# EAGLE design sqw_11p (EAGLE 5.11)
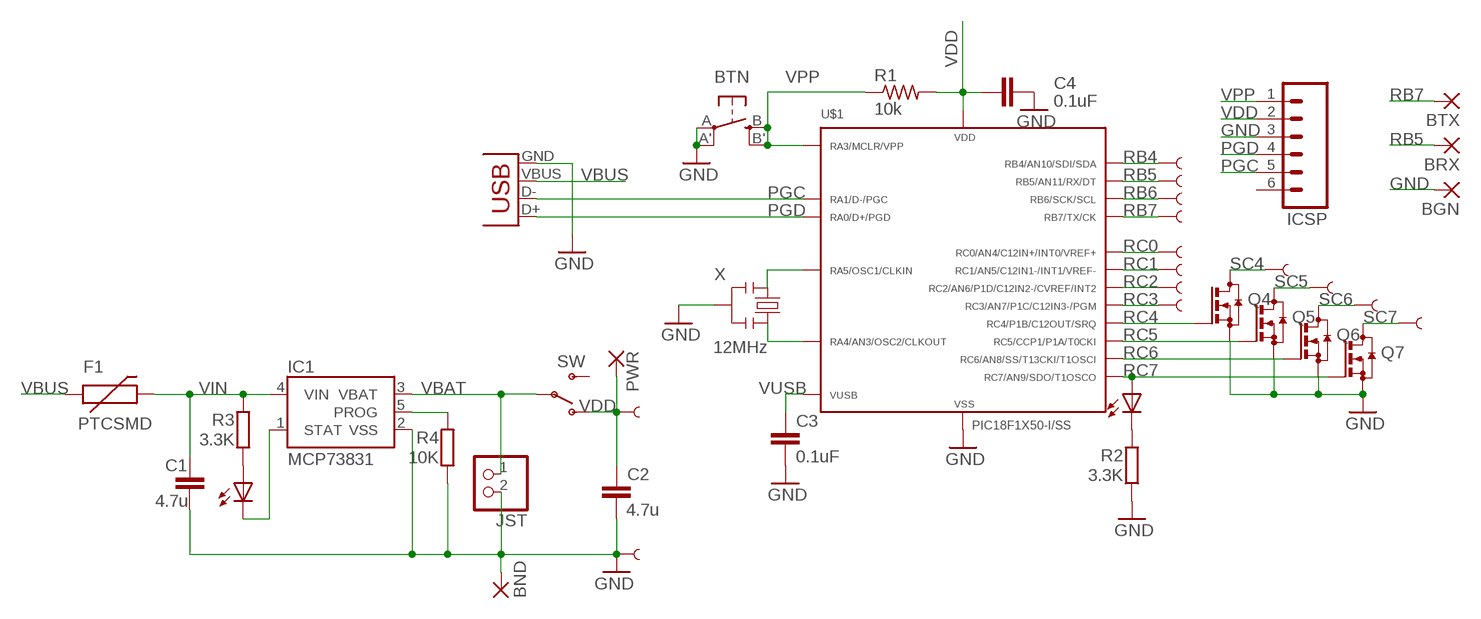
[diagram p0: schematic, sheet 1]

## Parts
BGN  SMD2  [SMD1,27-2,54]
BND  SMD2  [SMD1,27-2,54]
BRX  SMD2  [SMD1,27-2,54]
BTN  EVQQ2  [EVQ-Q2]
BTX  SMD2  [SMD1,27-2,54]
C1  4.7u  C-EUC0805  [C0805]
C2  4.7u  C-EUC0805  [C0805]
C3  0.1uF  C-EUC0805  [C0805]
C4  0.1uF  C-EUC0805  [C0805]
CHG  0805  LEDCHIPLED_0805  [CHIPLED_0805]
F1  PTCSMD  [PTC-1206]
IC1  MCP73831  [SOT23-5]
ICSP  M06SIP  [1X06]
JST  JST_2PIN-SMT-RA  [JST-PH-2-SMT-RA]
LED  0805  LEDCHIPLED_0805  [CHIPLED_0805]
PB4  SEWTAP61  [PETAL-SMALL-2SIDE1]
PB5  SEWTAP6  SEWTAP61  [PETAL-SMALL-2SIDE1]
PB6  SEWTAP6  SEWTAP61  [PETAL-SMALL-2SIDE1]
PB7  SEWTAP6  SEWTAP61  [PETAL-SMALL-2SIDE1]
PC0  SEWTAP6  SEWTAP61  [PETAL-SMALL-2SIDE1]
PC1  SEWTAP6  SEWTAP61  [PETAL-SMALL-2SIDE1]
PC2  SEWTAP6  SEWTAP61  [PETAL-SMALL-2SIDE1]
PC3  SEWTAP6  SEWTAP61  [PETAL-SMALL-2SIDE1]
PG  SEWTAP6  SEWTAP611  [PETAL-SMALL-2SIDE11]
PSC4  SEWTAP6  SEWTAP61  [PETAL-SMALL-2SIDE1]
PSC5  SEWTAP6  SEWTAP61  [PETAL-SMALL-2SIDE1]
PSC6  SEWTAP6  SEWTAP61  [PETAL-SMALL-2SIDE1]
PSC7  SEWTAP6  SEWTAP61  [PETAL-SMALL-2SIDE1]
PVCC  SEWTAP6  SEWTAP611  [PETAL-SMALL-2SIDE11]
PWR  SMD2  [SMD1,27-2,54]
Q4  BSS123  [SOT23]
Q5  BSS123  [SOT23]
Q6  BSS123  [SOT23]
Q7  BSS123  [SOT23]
R1  10k  R-US_R0805  [R0805@1]
R2  3.3K  R-EU_R0805  [R0805]
R3  3.3K  R-EU_R0805  [R0805]
R4  10K  R-EU_R0805  [R0805]
SW  SPDT  SWITCH-SPSTSMD2  [SWITCH-SPDT-SMD]
U$1  PIC18F1X50-I/SS  [SSOP20]
X  12MHz  RESONATORSMD  [RESONATOR-SMD]
X1  USBSMD  [USB-MINIB]

## Nets
GND: BGN.1(P) BND.1(P) BTN.A'(P1) BTN.A(P) C1.2 C2.2 C3.2 C4.2 IC1.2(VSS) ICSP.3 JST.2 PG.1 Q4.2(S) Q5.2(S) Q6.2(S) Q7.2(S) R2.1 R4.1 U$1.20 X1.GND X.2
N$2: U$1.2 X.1
N$3: U$1.3 X.3
N$4: CHG.A R3.1
N$5: CHG.C IC1.1(STAT)
N$6: IC1.5(PROG) R4.2
N$14: LED.C R2.2
PGC: ICSP.5 U$1.18 X1.D-
PGD: ICSP.4 U$1.19 X1.D+
RB4: PB4.1 U$1.13
RB5: BRX.1(P) PB5.1 U$1.12
RB6: PB6.1 U$1.11
RB7: BTX.1(P) PB7.1 U$1.10
RC0: PC0.1 U$1.16
RC1: PC1.1 U$1.15
RC2: PC2.1 U$1.14
RC3: PC3.1 U$1.7
RC4: Q4.1(G) U$1.6
RC5: Q5.1(G) U$1.5
RC6: Q6.1(G) U$1.8
RC7: LED.A Q7.1(G) U$1.9
SC4: PSC4.1 Q4.3(D)
SC5: PSC5.1 Q5.3(D)
SC6: PSC6.1 Q6.3(D)
SC7: PSC7.1 Q7.3(D)
VBAT: IC1.3(VBAT) JST.1 SW.2(P)
VBUS: F1.1 X1.VBUS
VDD: C2.1 C4.1 ICSP.2 PVCC.1 PWR.1(P) R1.2 SW.1(O) U$1.1
VIN: C1.1 F1.2 IC1.4(VIN) R3.2
VPP: BTN.B'(S1) BTN.B(S) ICSP.1 R1.1 U$1.4
VUSB: C3.1 U$1.17
Unconnected: ICSP.6 SW.3(S)

## Library data of the parts
BGN BND BRX BTX PWR = wirepad:SMD2: SMD PAD
BTN = adafruit:EVQQ2: SMT 6mm switch, EVQQ2 series http://www.ladyada.net/library/eagle
C1 C2 = resistor:C-EU: CAPACITOR, European symbol
C3 C4 = rcl:C-EU: CAPACITOR, European symbol
CHG LED = led:LED: LED OSRAM: - CHIPLED LG R971, LG N971, LY N971, LG Q971, LY Q971, LO R971, LY R971 LH N974, LH R974 LS Q976, LO Q976, LY Q976 LO Q996 - Hyper CHIPLED LW Q18S LB Q993, LB Q99A, LB R99A - SideLED LS A670, LO A670, LY A670, LG A670, LP A670 LB A673, LV A673, LT A673, LW A673 LH A674 LY A675 LS A676, LA A676, LO A676, LY A676, LW A676 LS A679, LY A679, LG A679 - Hyper Micro SIDELED® LS Y876, LA Y876, LO Y876, LY Y876 LT Y87S - SmartLED LW L88C, LW L88S LB L89C, LB L89S, LG L890 LS L89K, LO L89K, LY L89K LS L896, LA L896, LO L896, LY L896 - TOPLED LS T670, LO T670, LY T670, LG T670, LP T670 LSG T670, LSP T670, LSY T670, LOP T670, LYG T670 LG T671, LOG T671, LSG T671 LB T673, LV T673, LT T673, LW T673 LH T674 LS T676, LA T676, LO T676, LY T676, LB T676, LH T676, LSB T676, LW T676 LB T67C, LV T67C, LT T67C, LS T67K, LO T67K, LY T67K, LW E67C LS E67B, LA E67B, LO E67B, LY E67B, LB E67C, LV E67C, LT E67C LW T67C LS T679, LY T679, LG T679 LS T770, LO T770, LY T770, LG T770, LP T770 LB T773, LV T773, LT T773, LW T773 LH T774 LS E675, LA E675, LY E675, LS T675 LS T776, LA T776, LO T776, LY T776, LB T776 LHGB T686 LT T68C, LB T68C - Hyper Mini TOPLED® LB M676 - Mini TOPLED Santana® LG M470 LS M47K, LO M47K, LY M47K Source: http://www.osram.convergy.de LUXEON: - LUMILED® LXK2-PW12-R00, LXK2-PW12-S00, LXK2-PW14-U00, LXK2-PW14-V00 LXK2-PM12-R00, LXK2-PM12-S00, LXK2-PM14-U00 LXK2-PE12-Q00, LXK2-PE12-R00, LXK2-PE12-S00, LXK2-PE14-T00, LXK2-PE14-U00 LXK2-PB12-K00, LXK2-PB12-L00, LXK2-PB12-M00, LXK2-PB14-N00, LXK2-PB14-P00, LXK2-PB14-Q00 LXK2-PR12-L00, LXK2-PR12-M00, LXK2-PR14-Q00, LXK2-PR14-R00 LXK2-PD12-Q00, LXK2-PD12-R00, LXK2-PD12-S00 LXK2-PH12-R00, LXK2-PH12-S00 LXK2-PL12-P00, LXK2-PL12-Q00, LXK2-PL12-R00 Source: www.luxeon.com KINGBRIGHT: KA-3528ASYC Source: www.kingbright.com
F1 = SparkFun:PTC: Resettable Fuse PTC Resettable Fuse. Spark Fun Electronics SKU : COM-08357
IC1 = SparkFunNew:MCP73831: Microchip's MCP73831 Miniature single cell, fully integrated Li-Ion, Li-polymer charge management controller http://ww1.microchip.com/downloads/en/DeviceDoc/21984a.pdf
ICSP = SparkFunNew:M06: Header 6 Standard 6-pin 0.1" header. Use with straight break away headers (SKU : PRT-00116), right angle break away headers (PRT-00553), swiss pins (PRT-00743), machine pins (PRT-00117), and female headers (PRT-00115). Molex polarized connector foot print use with SKU : PRT-08094 with associated crimp pins and housings. NOTES ON THE VARIANTS LOCK and LOCK_LONGPADS... This footprint was designed to help hold the alignment of a through-hole component (i.e. 6-pin header) while soldering it into place. You may notice that each hole has been shifted either up or down by 0.005 of an inch from it's more standard position (which is a perfectly straight line). This slight alteration caused the pins (the squares in the middle) to touch the edges of the holes. Because they are alternating, it causes a "brace" to hold the component in place. 0.005 has proven to be the perfect amount of "off-center" position when using our standard breakaway headers. Although looks a little odd when you look at the bare footprint, once you have a header in there, the alteration is very hard to notice. Also, if you push a header all the way into place, it is covered up entirely on the bottom side. This idea of altering the position of holes to aid alignment will be further integrated into the Sparkfun Library for other footprints. It can help hold any component with 3 or more connection pins.
JST = adafruit:JST_2PIN: JST 2-Pin Connectors of various flavors SMT-RA (S2B-PH-SM4) 4UConnector #17311 SMT (B2B-PH-SM4) THM-RA (S2B-PH) THM (B2B-PH)
PB4-PB7 PC0 PC1-PC3 PG PSC4-PSC7 PVCC = LilyPad-Wearables:SEWTAP
Q4-Q7 = transistor-small-signal:BSS123: N-CHANNEL MOS FET
R1 = rcl:R-US_: RESISTOR, American symbol
R2-R4 = rcl:R-EU_: RESISTOR, European symbol
SW = SparkFun:SWITCH-SPST: SPST Switch Simple slide switch. Spark Fun Electronics SKU : COM-00102
U$1 = Forrequi:PIC18F1X50: PIC18F13K50/14K50 20-Pin USB Flash Microcontrollers with nanoWatt Technology The PIC18F14K50 brings advanced features and exceptional value to the embedded USB market. This low cost PIC® Microcontroller features a full speed USB 2.0 compliant interface that c an automatically change clock sources and power levels upon connection to a host, making it an exceptional device for battery-powered applications. The addition of mTouch(TM) touch sensing compatibility, a 10-bit ADC, motor control PWMs, and a host of serial interfaces make the PIC18F14K50 the perfect device to "Just add USB" to any application. Datasheet <http://ww1.microchip.com/downloads/en/DeviceDoc/41350C.pdf>
X = SparkFunNew:RESONATOR: Resonator Small SMD resonator. This is the itty bitty 10/20MHz resonators with built in caps. CSTCE10M0G55 and CSTCE20M0V53. Footprint has been reviewed closely but hasn't been tested yet.
X1 = SparkFun:USB: USB Connectors USB-B-PTH is fully proven SKU : PRT-00139 USB-miniB is fully proven SKU : PRT-00587 USB-A-PCB is untested. USB-A-H is throughly reviewed, but untested. Spark Fun Electronics SKU : PRT-00437 USB-B-SMT is throughly reviewed, but untested. Needs silkscreen touching up. USB-A-S has not been used/tested USB-MB-H has not been used/tested

## Net classes
0 default: width 0.254 mm, clearance 0.203 mm
1 power: width 0.254 mm, clearance 0.203 mm

## Board
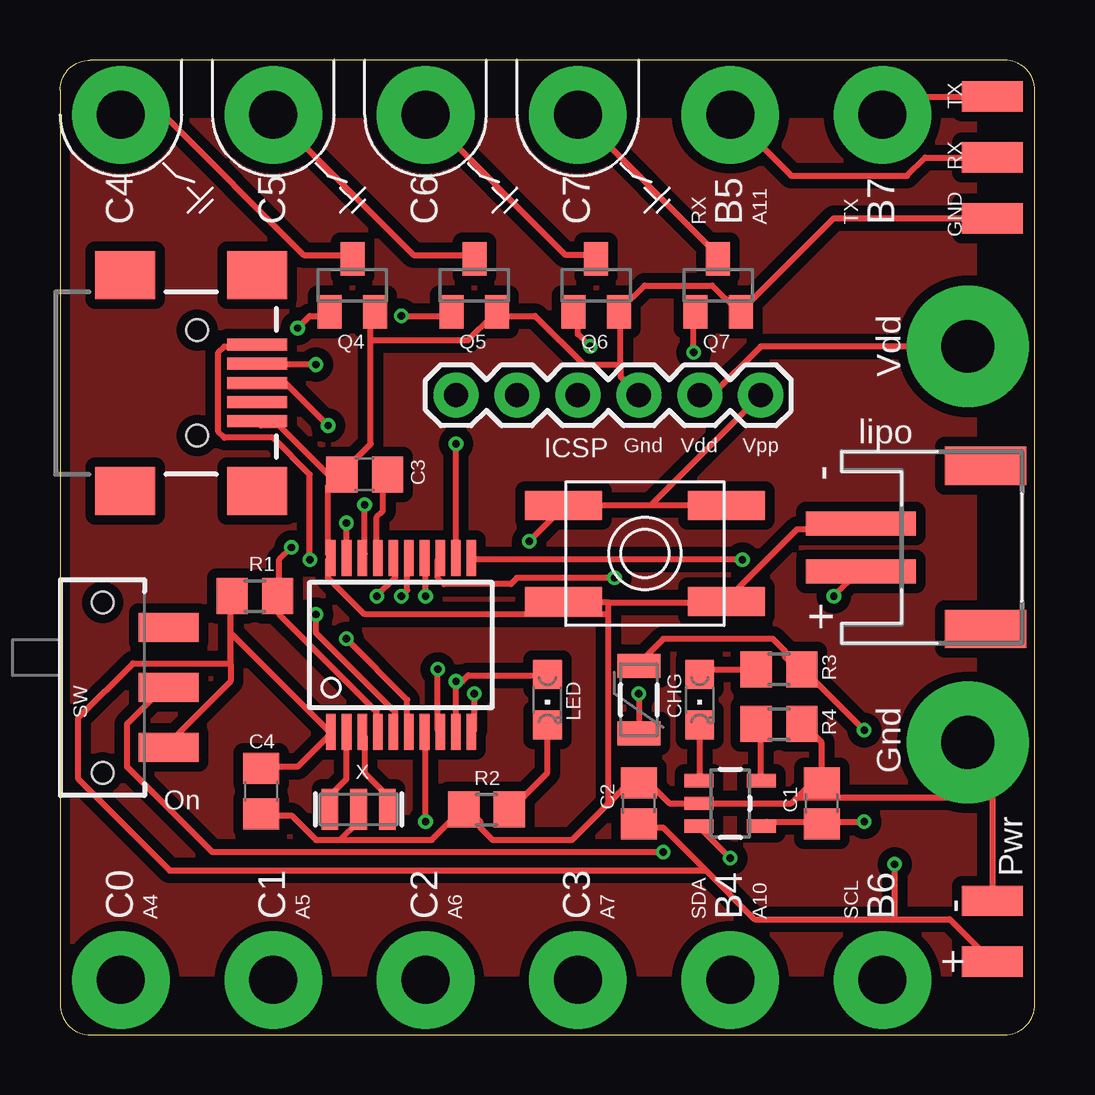
[diagram p1: board, top side]
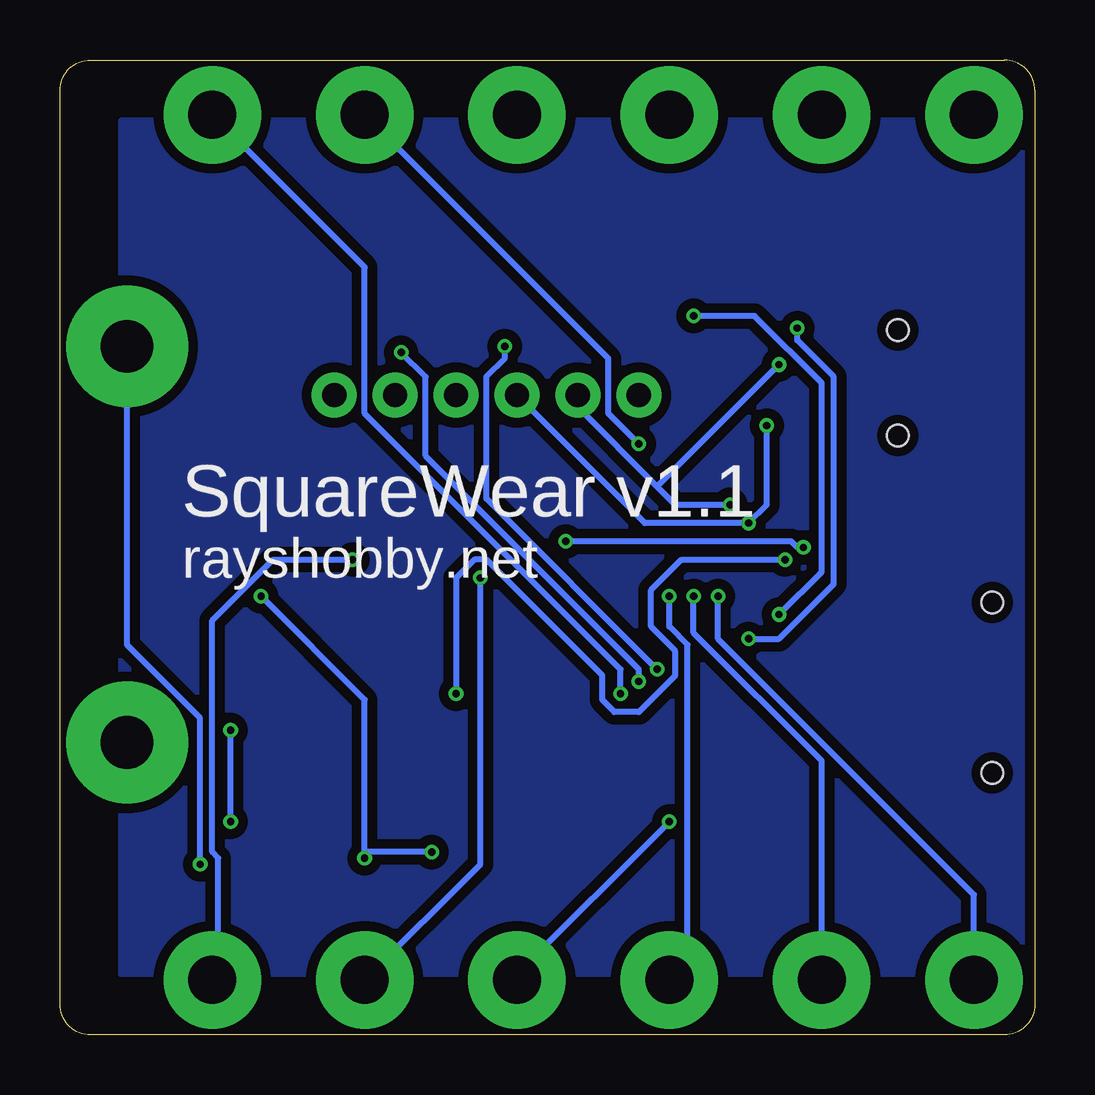
[diagram p2: board, bottom side, seen from below]

Size 40.64 x 40.64 mm. Coordinates in mm from the lower left corner, seen from the top.
Outline: 1.27,0 39.37,0 arc90 40.64,1.27 40.64,39.37 arc90 39.37,40.64 1.27,40.64 arc90 0,39.37 0,1.27 arc90 1.27,0
Copper layers (1*16): Top 0.035mm / dielectric 1.5mm / Bottom 0.035mm
Design rules "Fusion_eagle_rule_v1.1 *": minimum track width 6mil, minimum drill 12mil, track to track 6mil, track to pad 6mil, pad to pad 6mil, via to via 6mil, smd to smd 0mil, copper to edge 10mil, drill to drill 10mil, minimum pad ring 10mil, minimum via ring 6mil, stop-mask expansion 2mil, vias tented up to drill 100mil, thermal gap 20mil
vRestrict: area 34,10.9 to 35.1,13.7; area 34,27.4 to 35.1,30.2; area 36.8,38.6 to 37.6,39.6; area 36.8,36.1 to 37.6,37.1; area 36.8,33.3 to 37.6,34.8; area 7.9,19.3 to 8.9,20.1; area 7.9,11.9 to 8.9,12.7; area 19.8,24.1 to 30,24.9; area 25.7,7.9 to 30.2,11.2; area 1.8,4.8 to 35.3,6.6; area 1.8,33.8 to 34.8,35.6; area 10.7,29.5 to 13.7,33; 3 more areas

### Footprints (pad centres in the part's own frame; a part is rotated, then mirrored left to right if it is on the bottom)
SMD1,27-2,54 = smd 1.27 x 2.54: 1 0,0
EVQ-Q2 = smd 3.2 x 1.2: A -3.4,-2; A' 3.4,-2; B -3.4,2; B' 3.4,2
C0805 = smd 1.3 x 1.5: 1 -0.85,0; 2 0.85,0
C0805' = smd 1.3 x 1.5: 1 -0.95,0; 2 0.95,0
CHIPLED_0805 = smd 1.2 x 1.2: A 0,-1.05; C 0,1.05
PTC-1206 = smd 1 x 1.8: 1 -1.4,0; 2 1.4,0
SOT23-5 = smd 0.55 x 1.2: 1 -0.95,-1.3; 2 0,-1.3; 3 0.95,-1.3; 4 0.95,1.3; 5 -0.95,1.3
1X06 = drill 1.016 pad 1.88 round: 1 0,0; 2 2.54,0; 3 5.08,0; 4 7.62,0; 5 10.16,0; 6 12.7,0
JST-PH-2-SMT-RA = smd 1 x 4.6: 1 1,-3.7; 2 -1,-3.7 | smd 1.6 x 3.4: NC1 -3.4,1.5; NC2 3.4,1.5
PETAL-SMALL-2SIDE1 = drill 2 pad 4.064 round: 1 0,0
PETAL-SMALL-2SIDE11 = drill 2.2 pad 5.08 round: 1 0,0
SOT23 = smd 1 x 1.4: 1 -0.95,-1.1; 2 0.95,-1.1; 3 0,1.1
R0805@1 = smd 1.3 x 1.5: 1 -0.95,0; 2 0.95,0
R0805 = smd 1.3 x 1.5: 1 -0.95,0; 2 0.95,0
SWITCH-SPDT-SMD = smd 1.2 x 2.5: 1 -2.5,-2.75; 2 0,-2.75; 3 2.5,-2.75 | hole 0.9: -3.55,0; 3.55,0
SSOP20 = smd 0.4 x 1.5: 1 -2.925,-3.625; 2 -2.275,-3.625; 3 -1.625,-3.625; 4 -0.975,-3.625; 5 -0.325,-3.625; 6 0.325,-3.625; 7 0.975,-3.625; 8 1.625,-3.625; 9 2.275,-3.625; 10 2.925,-3.625; 11 2.925,3.625; 12 2.275,3.625; 13 1.625,3.625; 14 0.975,3.625; 15 0.325,3.625; 16 -0.325,3.625; 17 -0.975,3.625; 18 -1.625,3.625; 19 -2.275,3.625; 20 -2.925,3.625
RESONATOR-SMD = smd 0.7 x 1.7: 1 -1.2,0; 2 0,0; 3 1.2,0
USB-MINIB = smd 2.5 x 0.5: D+ 2.5,0; D- 2.5,0.8; GND 2.5,-1.6; ID 2.5,-0.8; VBUS 2.5,1.6 | smd 2.5 x 2: GND@1 -3,-4.5; GND@2 -3,4.5; GND@3 2.5,4.5; GND@4 2.5,-4.5 | hole 0.9: 0,2.2; 0,-2.2

### Placement (x,y rotation side)
BGN  38.86,34.04 270 top
BND  38.86,5.59 90 top
BRX  38.86,36.58 90 top
BTN  24.38,20.07 0 top
BTX  38.86,39.12 90 top
C1  31.75,9.65 90 top
C2  24.13,9.65 90 top
C3  0.1uF  [C0805']  12.7,23.37 180 top
C4  0.1uF  [C0805']  8.38,10.16 270 top
CHG  26.67,13.97 180 top
F1  24.13,13.97 90 top
IC1  27.94,9.65 270 top
ICSP  29.21,26.67 180 top
JST  37.08,20.32 270 top
LED  20.32,13.97 180 top
PB4  27.94,2.29 180 top
PB5  27.94,38.35 180 top
PB6  34.29,2.29 180 top
PB7  34.29,38.35 180 top
PC0  2.54,2.29 0 top
PC1  8.89,2.29 0 top
PC2  15.24,2.29 0 top
PC3  21.59,2.29 0 top
PG  37.85,12.19 270 top
PSC4  2.54,38.35 90 top
PSC5  8.89,38.35 180 top
PSC6  15.24,38.35 180 top
PSC7  21.59,38.35 0 top
PVCC  37.85,28.7 180 top
PWR  38.86,3.05 90 top
Q4  12.19,31.24 0 top
Q5  17.27,31.24 0 top
Q6  22.35,31.24 0 top
Q7  27.43,31.24 0 top
R1  8.13,18.29 180 top
R2  17.78,9.4 0 top
R3  29.97,15.24 0 top
R4  29.97,12.95 180 top
SW  1.78,14.48 90 top
U$1  14.22,16.26 0 top
X  12.45,9.4 0 top
X1  5.71,27.18 0 top

### Tracks (layer width: path | path; a pad name or v marks a point on that pad's centre or on a via)
GND
  Top 0.254: 12.95,28.96 12.95,24.64 11.68,23.37 | 12.95,28.96 12.95,29.97 Q4.2 | 12.95,28.96 17.02,28.96 18.03,29.97 Q5.2 18.29,29.97 19.81,29.97 21.84,27.94 23.37,27.94 | 11.43,23.11 11.68,23.37 | 11.43,23.11 11.18,22.86 11.18,20.07 U$1.20 11.18,19.81 11.18,19.05 12.7,17.53 22.86,17.53 | 11.68,23.37 C3.2 11.43,23.11 | 11.43,23.11 9.14,25.4 8.38,25.4 X1.GND | 23.37,27.94 23.37,27.43 ICSP.3 | 23.37,27.94 23.37,29.97 Q6.2 23.37,30.23 24.38,31.24 27.18,31.24 28.19,30.23 Q7.2 28.45,30.23 32.26,34.04 BGN.1 | 38.86,9.91 38.86,11.18 PG.1 38.86,9.91 | 38.86,9.91 BND.1 | 22.86,18.03 27.69,18.03 BTN.A' 27.94,18.29 30.73,21.08 33.27,21.08 JST.2 | 22.86,18.03 21.08,18.03 BTN.A | 11.68,8.13 10.67,8.13 9.65,9.14 8.38,9.14 C4.2 | 11.68,8.13 12.45,8.89 X.2 | 11.68,8.13 15.49,8.13 16.76,9.4 R2.1 17.02,9.4 17.53,8.89 17.53,8.64 18.03,8.13 21.34,8.13 22.86,9.65 | 24.13,10.41 24.64,10.41 25.4,9.65 IC1.2 30.48,9.65 30.73,9.91 | 31.75,10.92 31.75,12.19 30.99,12.95 R4.1 | 31.75,10.92 C1.2 31.75,10.67 | 30.73,9.91 31.75,10.92 | 22.86,9.65 23.62,10.41 24.13,10.41 | 24.13,10.41 C2.2 | 22.86,9.65 22.86,17.53 | 22.86,17.53 22.86,18.03 | 30.73,9.91 38.86,9.91
N$1
  pour Top (isolate 0.406): 0,38.1 38.1,38.1 38.1,2.54 0,2.54
N$2
  Top 0.254: U$1.2 11.94,12.45 11.94,10.67 11.43,10.16 11.43,9.4 X.1
N$3
  Top 0.254: U$1.3 12.7,12.45 12.7,10.92 13.46,10.16 13.46,9.4 X.3
N$4
  Top 0.254: CHG.A 26.67,15.24 R3.1
N$5
  Top 0.254: IC1.1 26.67,10.67 CHG.C
N$6
  Top 0.254: IC1.5 29.21,10.67 29.21,12.95 R4.2
N$7
  pour Bottom (isolate 0.406): 0,38.1 38.1,38.1 38.1,2.54 0,2.54
N$14
  Top 0.254: LED.C 20.32,10.92 18.8,9.4 R2.2
PGC  (via drill 0.3)
  Top 0.254: v12.7,22.1 12.7,20.07 U$1.18 | v10.67,27.94 8.38,27.94 X1.D-
  Bottom 0.254: v12.7,22.1 14.99,22.1 15.75,22.86 | 15.75,22.86 19.05,26.16 ICSP.5 | 15.75,22.86 v10.67,27.94
PGD  (via drill 0.3)
  Top 0.254: v11.94,21.34 11.94,20.07 U$1.19 | v11.18,25.4 9.4,27.18 X1.D+
  Bottom 0.254: ICSP.4 16.26,21.34 v11.94,21.34 11.18,22.1 v11.18,25.4
RB4  (via drill 0.3)
  Top 0.254: v23.11,19.05 19.05,19.05 18.8,18.8 16,18.8 15.75,19.05 15.75,19.81 U$1.13
  Bottom 0.254: v23.11,19.05 23.11,7.11 PB4.1
RB5  (via drill 0.3)
  Top 0.254: v16.51,24.64 16.51,20.07 U$1.12 | BRX.1 36.07,36.58 35.31,35.81 30.48,35.81 PB5.1
  Bottom 0.254: v16.51,24.64 17.78,25.91 17.78,28.19 PB5.1
RB6  (via drill 0.3)
  Top 0.254: v28.45,19.81 17.27,19.81 U$1.11
  Bottom 0.254: v28.45,19.81 31.75,19.81 34.29,17.27 34.29,7.62 34.04,7.37 34.04,2.54 PB6.1
RB7  (via drill 0.3)
  Top 0.254: v17.27,14.22 17.27,12.7 U$1.10 | BTX.1 35.05,39.12 PB7.1
  Bottom 0.254: v17.27,14.22 17.27,15.24 27.94,25.91 27.94,32 PB7.1
RC0  (via drill 0.3)
  Top 0.254: v13.21,18.29 13.97,19.05 13.97,19.81 U$1.16
  Bottom 0.254: v13.21,18.29 13.21,16.51 2.54,5.84 PC0.1
RC1  (via drill 0.3)
  Top 0.254: v14.22,18.29 14.48,18.54 14.48,19.81 U$1.15
  Bottom 0.254: v14.22,18.29 14.22,16.76 8.89,11.43 PC1.1
RC2  (via drill 0.3)
  Top 0.254: v15.24,18.29 15.24,19.81 U$1.14
  Bottom 0.254: v15.24,18.29 15.24,17.02 14.48,16.26 14.48,3.05 PC2.1
RC3  (via drill 0.3)
  Top 0.254: v15.24,8.89 15.24,12.45 U$1.7
  Bottom 0.254: v15.24,8.89 21.59,2.54 PC3.1
RC4  (via drill 0.3)
  Top 0.254: v9.91,29.46 10.41,29.97 11.18,29.97 Q4.1 | v11.94,16.51 14.48,13.97 14.48,12.7 U$1.6
  Bottom 0.254: v9.91,29.46 9.91,28.96 8.38,27.43 8.38,18.8 10.67,16.51 v11.94,16.51
RC5  (via drill 0.3)
  Top 0.254: v14.22,29.97 16.26,29.97 Q5.1 | v10.67,17.53 10.67,16.76 13.97,13.46 13.97,12.7 U$1.5
  Bottom 0.254: v14.22,29.97 11.68,29.97 8.89,27.18 8.89,19.3 v10.67,17.53
RC6  (via drill 0.3)
  Top 0.254: v22.1,28.7 21.59,29.21 21.59,29.97 Q6.1 | v15.75,15.24 15.75,12.7 U$1.8
  Bottom 0.254: v22.1,28.7 22.1,28.19 22.86,27.43 22.86,22.35 v15.75,15.24
RC7  (via drill 0.3)
  Top 0.254: 16.76,14.73 16.51,14.48 16.51,12.7 U$1.9 | 16.76,14.73 17.02,14.99 20.32,14.99 LED.A | v26.42,28.45 26.42,29.97 Q7.1 | 16.76,14.73 v16.51,14.73
  Bottom 0.254: v26.42,28.45 25.4,27.43 25.4,24.13 16.51,15.24 v16.51,14.73
SC4
  Top 0.254: PSC4.1 4.32,38.35 10.16,32.51 12.19,32.51 Q4.3
SC5
  Top 0.254: PSC5.1 14.73,32.51 17.27,32.51 Q5.3
SC6
  Top 0.254: PSC6.1 21.08,32.51 22.35,32.51 Q6.3
SC7
  Top 0.254: PSC7.1 27.43,32.51 Q7.3
VBAT  (via drill 0.3)
  Top 0.254: v27.94,7.37 26.67,8.64 IC1.3 | v32.26,18.29 33.27,19.3 JST.1 | v25.15,7.62 6.35,7.62 2.79,11.18 2.79,12.95 4.32,14.48 SW.2
  Bottom 0.254: 27.94,7.62 27.94,13.97 v32.26,18.29 | v25.15,7.62 27.94,7.62 | 27.94,7.62 v27.94,7.37
VBUS  (via drill 0.3)
  Top 0.254: v10.41,19.81 10.41,23.37 8.89,24.89 6.86,24.89 6.6,25.15 6.6,28.45 6.86,28.7 8.13,28.7 X1.VBUS | v24.13,14.22 F1.1
  Bottom 0.254: v24.13,14.22 24.13,19.05 23.37,19.81 22.86,19.81 18.03,14.99 18.03,13.97 17.53,13.46 16.51,13.46 14.99,14.99 14.99,16 16,17.02 16,18.54 14.73,19.81 v10.41,19.81
VDD  (via drill 0.3)
  Top 0.254: ICSP.2 27.18,26.67 29.21,28.7 PVCC.1 | C4.1 8.38,11.18 9.91,11.18 11.18,12.45 U$1.1 11.18,12.7 7.11,16.76 | 7.11,15.49 7.11,14.73 4.57,12.19 SW.1 | 7.11,15.49 7.11,16.76 | 7.11,16.76 7.11,18.29 R1.2 | 26.92,6.86 28.96,4.83 34.8,4.83 | 26.92,6.86 25.15,8.64 24.13,8.64 C2.1 | 34.8,4.83 37.08,4.83 PWR.1 | 7.11,15.49 3.05,15.49 0.76,13.21 0.76,10.67 4.57,6.86 26.92,6.86 | 34.8,4.83 v34.8,7.11
  Bottom 0.254: PVCC.1 37.85,16.26 34.8,13.21 v34.8,7.11
VIN  (via drill 0.3)
  Top 0.254: 31.75,8.89 29.46,8.89 IC1.4 | F1.2 24.13,15.49 25.15,16.51 29.72,16.51 30.23,16 30.23,15.75 30.73,15.24 R3.2 30.99,15.24 v33.53,12.7 | 31.75,8.89 v33.53,8.89 | 31.75,8.89 C1.1
  Bottom 0.254: v33.53,8.89 v33.53,12.7
VPP  (via drill 0.3)
  Top 0.254: 9.14,18.29 9.14,17.53 13.21,13.46 13.21,12.7 U$1.4 | 24.64,22.1 27.69,22.1 BTN.B' | 24.64,22.1 21.08,22.1 BTN.B 20.83,21.84 v19.56,20.57 | 24.64,22.1 ICSP.1 | 9.14,18.29 9.14,19.81 v9.65,20.32 | 9.14,18.29 R1.1
  Bottom 0.254: v9.65,20.32 9.91,20.32 10.16,20.57 v19.56,20.57
VUSB
  Top 0.254: U$1.17 13.21,20.07 13.21,21.59 13.46,21.84 13.46,23.37 C3.1

### Text on the board
tNames: TX | RX | C4 | C5 | C6 | C7 | RX | B5 | A11 | TX | B7 | GND | Vdd | Gnd | Vdd | Vpp | lipo | Gnd | On | Pwr | C0 | A4 | C1 | A5 | C2 | A6 | C3 | A7 | SDA | B4 | A10 | SCL | B6 | - | +
bNames: SquareWear v1.1 | rayshobby.net